# Altium schematic sheet LCD.SchDoc
size A4
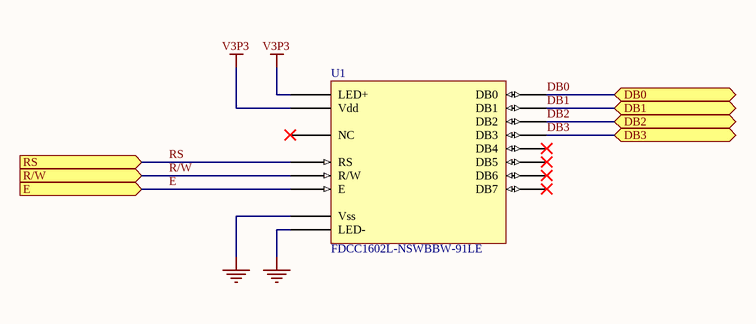
[diagram p0: LCD.SchDoc]

## Parts
U1  FDCC1602L-NSWBBW-91LE  [LCD (Only header)]

## Ports
DB0 (bidir), DB1 (bidir), DB2 (bidir), DB3 (bidir), E (in), R/W (in), RS (in)

## Nets
GND: U1.1(Vss) U1.16(LED-)
V3P3: U1.2(Vdd) U1.15(LED+)
DB0: U1.7(DB0) ; port DB0
DB1: U1.8(DB1) ; port DB1
DB2: U1.9(DB2) ; port DB2
DB3: U1.10(DB3) ; port DB3
E: U1.6(E) ; port E
R/W: U1.5(R/W) ; port R/W
RS: U1.4(RS) ; port RS

Not connected (* = marked no-connect by the designer): U1 3(NC)* 11(DB4)* 12(DB5)* 13(DB6)* 14(DB7)*

## Notes on the sheet
- Title
- Size:
- Date:
- A4
- Number:
- Time:
- Revision:
- Sheet
- of
- File:

## Library data of the parts
U1 = FDCC1602L-NSWBBW-91LE: Fournisseur: Farnell; RefFournisseur: 1847941; Fabricant: FORDATA; RefFabricant: FDCC1602L-NSWBBW-91LE